# EAGLE design untitled (EAGLE 9.6.2)
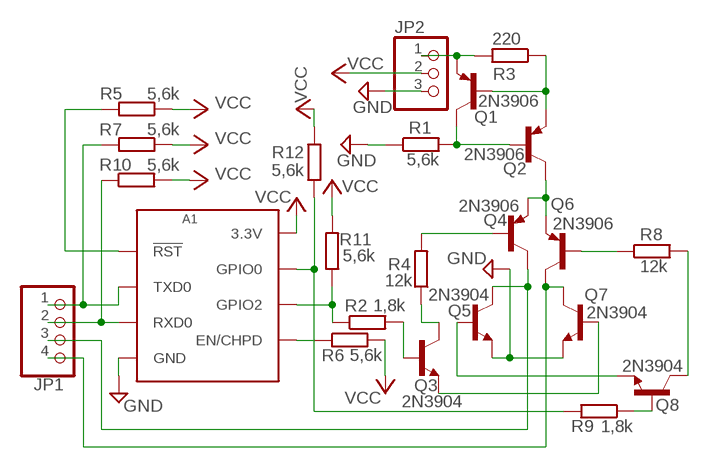
[diagram p0: schematic, sheet 1]

## Parts
A1  ESP8266_ESP-01  [ESP8266_ESP-01_NO-SILKSCREEN]
JP1  PINHD-1X4  [1X04]
JP2  PINHD-1X3  [1X03]
Q1  2N3906  2N3906-PNP-TO92-EBC  [TO92-EBC]
Q2  2N3906  2N3906-PNP-TO92-EBC  [TO92-EBC]
Q3  2N3904  2N3904-NPN-TO92-EBC  [TO92-EBC]
Q4  2N3906  2N3906-PNP-TO92-EBC  [TO92-EBC]
Q5  2N3904  2N3904-NPN-TO92-EBC  [TO92-EBC]
Q6  2N3906  2N3906-PNP-TO92-EBC  [TO92-EBC]
Q7  2N3904  2N3904-NPN-TO92-EBC  [TO92-EBC]
Q8  2N3904  2N3904-NPN-TO92-EBC  [TO92-EBC]
R1  5,6k  R-EU_0204/7  [0204/7]
R2  1,8k  R-EU_0204/7  [0204/7]
R3  220  R-EU_0204/7  [0204/7]
R4  12k  R-EU_0204/7  [0204/7]
R5  5,6k  R-EU_0204/7  [0204/7]
R6  5,6k  R-EU_0204/7  [0204/7]
R7  5,6k  R-EU_0204/7  [0204/7]
R8  12k  R-EU_0204/7  [0204/7]
R9  1,8k  R-EU_0204/7  [0204/7]
R10  5,6k  R-EU_0204/7  [0204/7]
R11  5,6k  R-EU_0204/7  [0204/7]
R12  5,6k  R-EU_0204/7  [0204/7]

## Nets
GND: A1.GND JP2.3 Q5.E Q7.E R1.1
N$1: A1.RST(!RST!) R5.2
N$2: A1.EN/CH_PD(EN/CHPD) R6.1
N$4: A1.RX(RXD0) JP1.2 R10.1
N$6: A1.GPIO0 R9.2 R12.1
N$7: Q3.B R2.2
N$8: Q3.C R4.1
N$9: Q4.B R4.2
N$10: Q2.C Q4.E Q6.E
N$11: Q1.C Q2.B R1.2
N$12: JP1.3 Q4.C Q5.C
N$13: JP2.1 Q1.E R3.2
N$14: Q1.B Q2.E R3.1
N$15: JP1.4 Q6.C Q7.C
N$16: Q6.B R8.1
N$17: Q3.E Q7.B
N$18: Q8.C R8.2
N$19: Q5.B Q8.E
N$20: Q8.B R9.1
N$21: A1.GPIO2 R2.1 R11.1
N$23: A1.TX(TXD0) JP1.1 R7.2
VCC: A1.3V3(3.3V) JP2.2 R5.1 R6.2 R7.1 R10.2 R11.2 R12.2

## Library data of the parts
A1 = LuisLab-Boards:ESP8266_ESP-?
JP1 = pinhead:PINHD-1X4: PIN HEADER
JP2 = pinhead:PINHD-1X3: PIN HEADER
Q1 Q2 Q4 Q6 = transistor-neu-to92:*-PNP-: PNP Transistror
Q3 Q5 Q7 Q8 = transistor-neu-to92:*-NPN-: NPN Transistror
R1-R12 = rcl:R-EU_: RESISTOR, European symbol; SPICEPREFIX: R

## Board
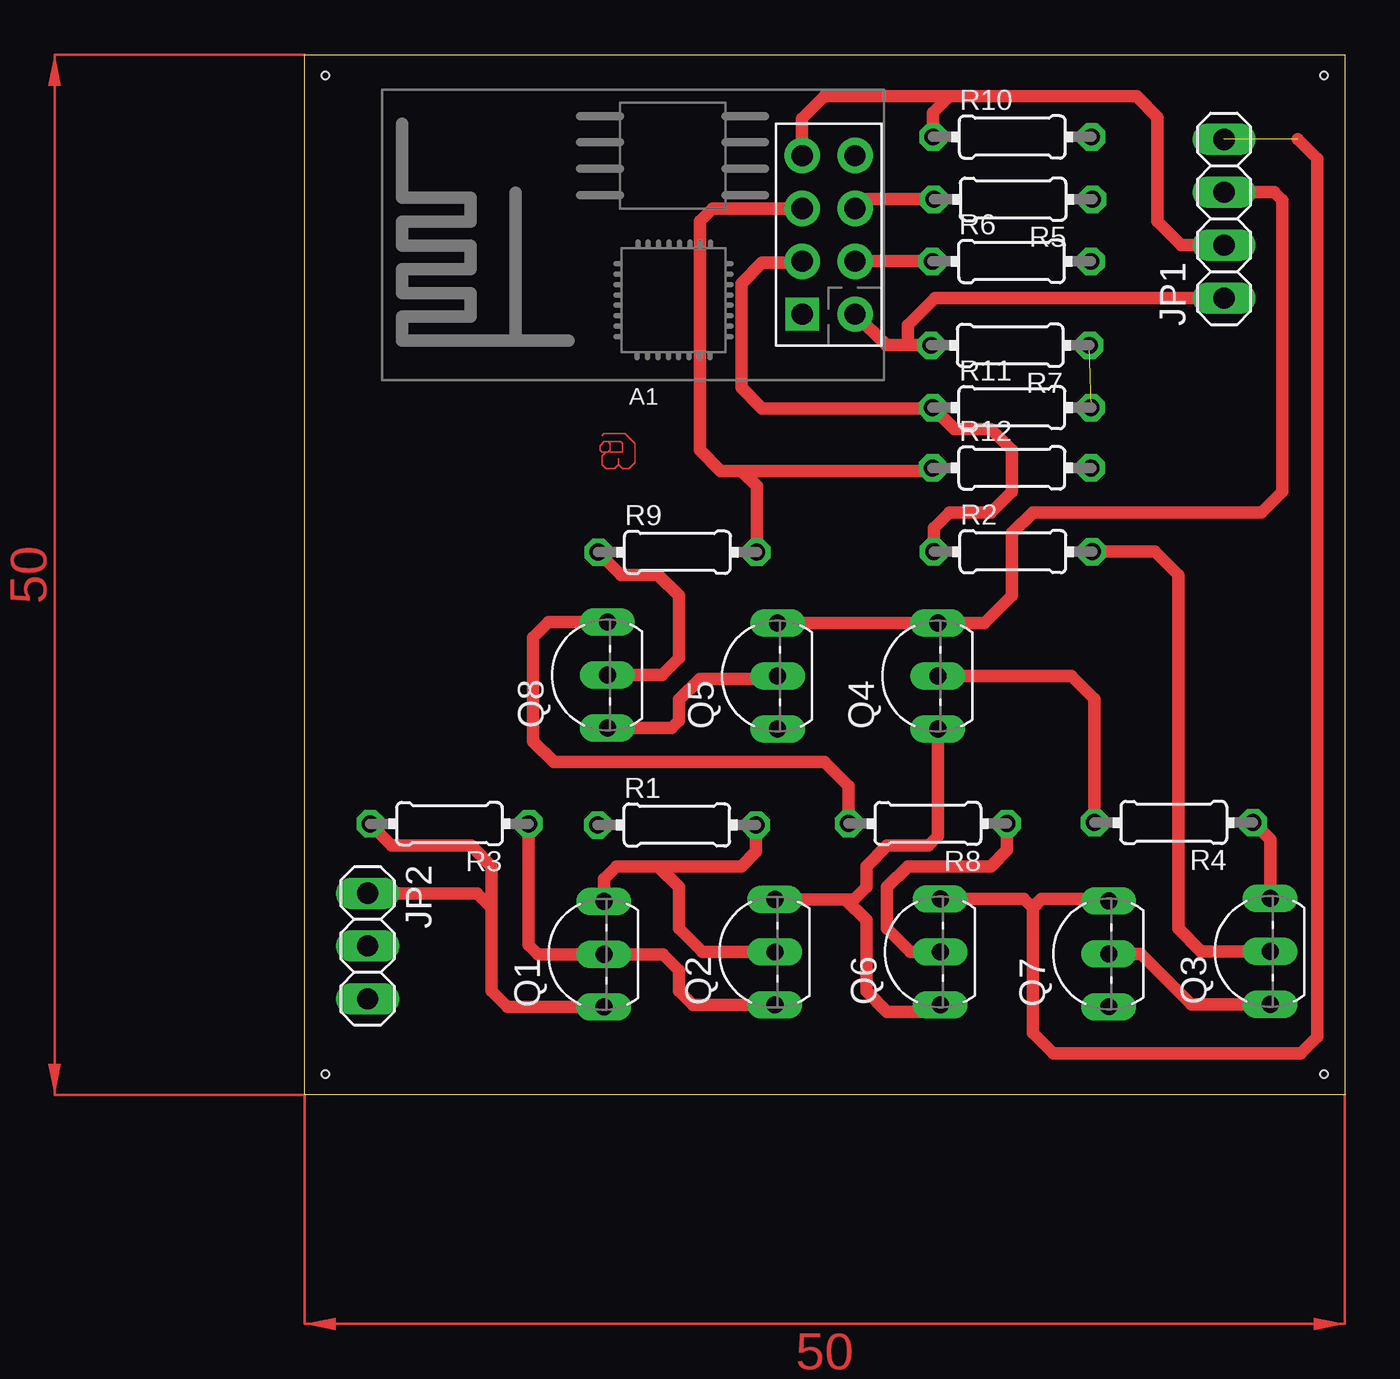
[diagram p1: board, top side]
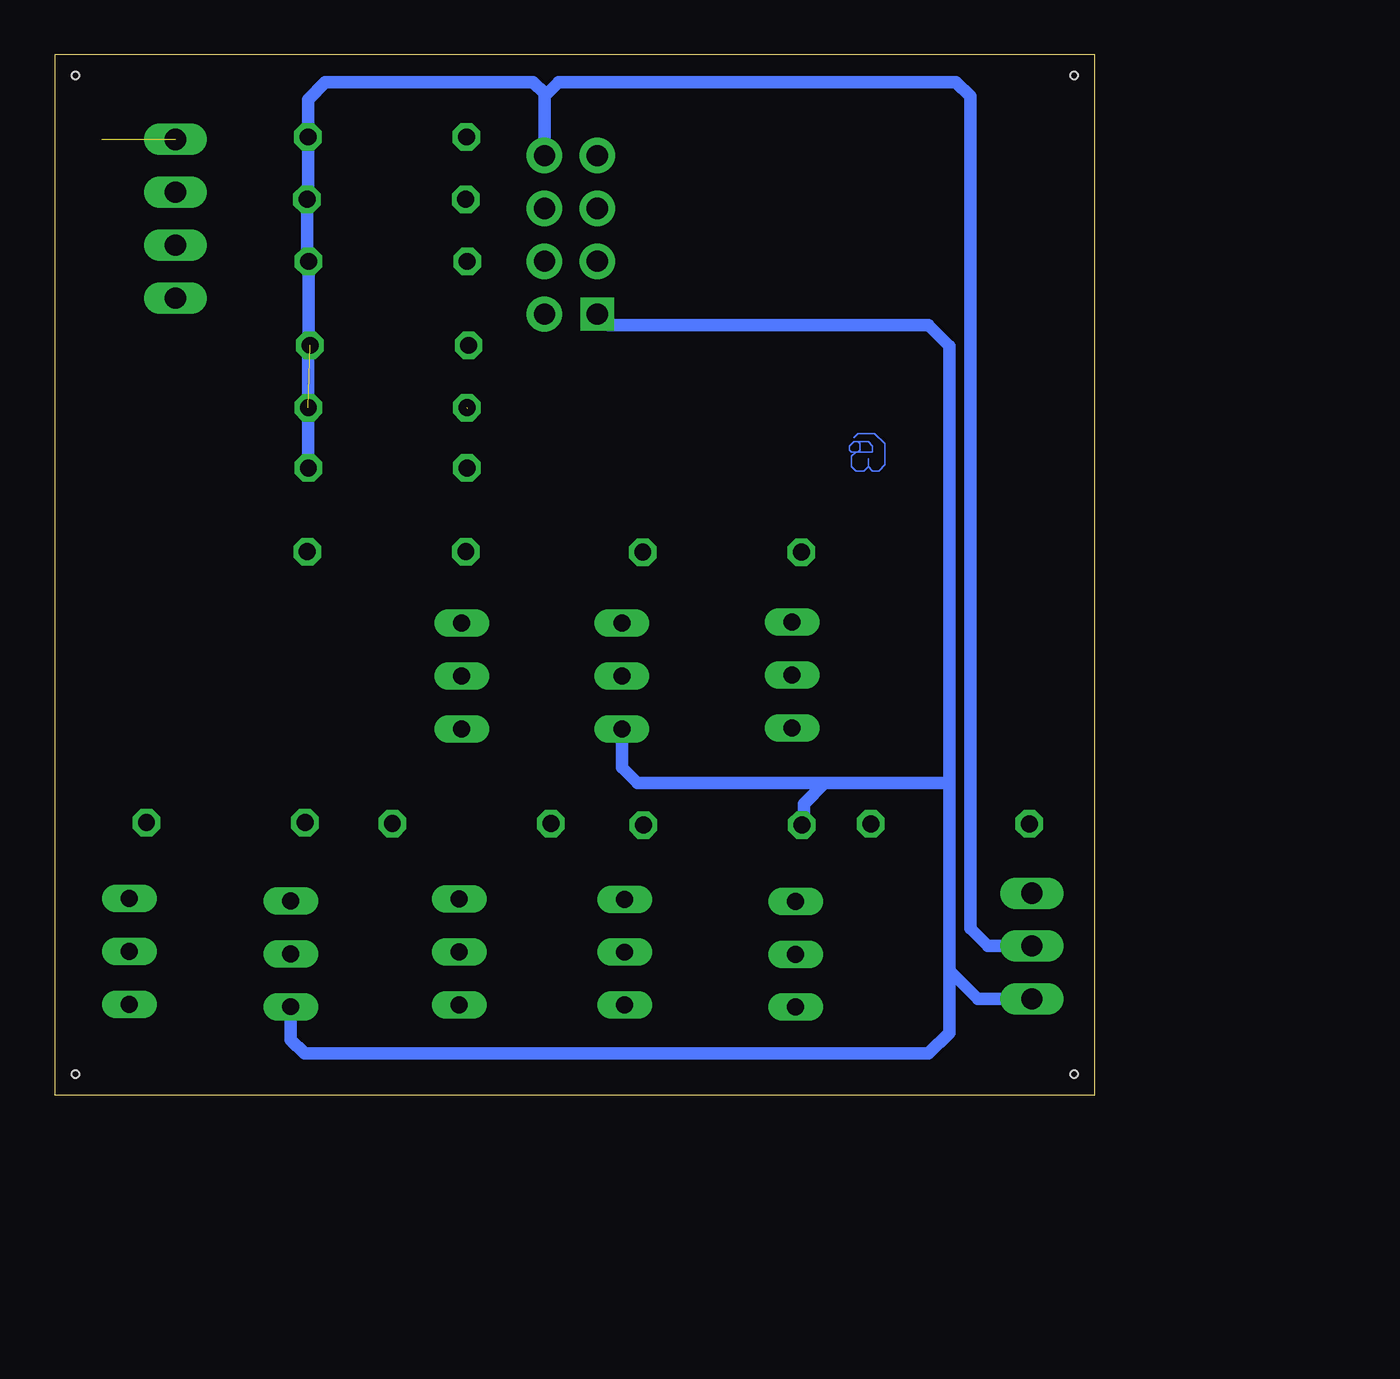
[diagram p2: board, bottom side, seen from below]

Size 50 x 50 mm. Coordinates in mm from the lower left corner, seen from the top.
Outline: 0,50 50,50 50,0 0,0 0,50
Copper layers (1*16): Top 0.035mm / dielectric 1.5mm / Bottom 0.035mm
Design rules "default": minimum track width 6mil, minimum drill 0.35mm, track to track 6mil, track to pad 6mil, pad to pad 6mil, via to via 6mil, smd to smd 6mil, copper to edge 40mil, drill to drill 6mil, minimum pad ring 10mil, minimum via ring 8mil, stop-mask expansion 4mil, vias tented up to drill 0mil, thermal gap 10mil
Holes 0.35 mm at 1,49 1,1 49,1 49,49

### Footprints (pad centres in the part's own frame; a part is rotated, then mirrored left to right if it is on the bottom)
ESP8266_ESP-01_NO-SILKSCREEN = drill 1.016 pad 1.7: 3V3 -1.27,-3.81; EN/CH_PD -1.27,1.27; GPIO0 1.27,-1.27; GPIO2 1.27,1.27; RST -1.27,-1.27; RX 1.27,-3.81; TX -1.27,3.81 | drill 1.016 pad 1.6 square: GND 1.27,3.81
1X04 = drill 1.016 long: 1 -3.81,0; 2 -1.27,0; 3 1.27,0; 4 3.81,0
1X03 = drill 1.016 long: 1 -2.54,0; 2 0,0; 3 2.54,0
TO92-EBC = drill 0.813 long: B 0,-1.27; C 2.54,-1.27; E -2.54,-1.27
0204/7 = drill 0.813 octagon: 1 -3.81,0; 2 3.81,0

### Placement (x,y rotation side)
A1  25.19,41.34 180 top
JP1  44.2,42.12 90 top
JP2  3.03,7.16 270 top
Q1  13.12,6.77 90 top
Q2  21.34,6.87 90 top
Q3  45.14,6.91 90 top
Q4  29.17,20.14 90 top
Q5  21.47,20.14 90 top
Q6  29.29,6.88 90 top
Q7  37.39,6.79 90 top
Q8  13.29,20.19 90 top
R1  17.9,12.98 0 top
R2  34.05,26.12 0 top
R3  6.97,13.04 180 top
R4  41.78,13.1 180 top
R5  34.06,43.05 180 top
R6  33.99,40.07 0 top
R7  33.92,36.03 180 top
R8  29.96,13.05 180 top
R9  17.93,26.09 0 top
R10  34.02,46.05 0 top
R11  34,33.04 0 top
R12  34,30.14 0 top

### Tracks (layer width: path | path; a pad name or v marks a point on that pad's centre or on a via)
GND
  Bottom 0.61: A1.GND 23.39,37 8,37 7,36 7,15 | 13,15 7,15 | R1.1 14,13.07 14,14 13,15 | Q5.E 22.74,15.74 22,15 13,15 | 7,6 7,15 | Q7.E 38.66,2.66 38,2 8,2 7,3 7,6 | JP2.3 5.62,4.62 7,6
N$1
  Top 0.61: A1.RST 26.9,43.05 R5.2
N$2
  Top 0.61: A1.EN/CH_PD R6.1
N$4
  Top 0.61: A1.RX 23.92,46.92 25,48 31,48 | 31,48 40,48 41,47 41,42 42.15,40.85 JP1.2 | R10.1 30.21,47.21 31,48
N$5
  Top 0.076: 14.3,31.7 14.4,31.8 15.4,31.8 15.9,31.3 15.9,30.4 15.6,30.1 15.3,30.1 15.1,30.3 | 15.1,30.3 15.1,30.6 | 15.1,30.3 14.9,30.1 14.5,30.1 14.3,30.3 14.3,30.7 14.5,30.9 | 14.6,30.9 15.3,30.9 15.3,31.3 15.2,31.4 14.6,31.4 | 14.5,30.9 14.3,30.9 14.2,31 14.2,31.2 14.4,31.4 14.6,31.4 | 14.5,30.9 14.6,30.9 | 14.6,30.9 14.7,31 14.7,31.3 14.6,31.4
N$6
  Top 0.61: A1.GPIO0 19.61,42.61 19,42 19,31 20,30 21,30 | 21,30 30.05,30 R12.1 | R9.2 21.74,29.26 21,30
N$7
  Top 0.61: Q3.B 43.09,6.91 42,8 42,25 40.88,26.12 R2.2
N$8
  Top 0.61: Q3.C 46.41,12.28 R4.1
N$9
  Top 0.61: R4.2 37.97,19.03 36.86,20.14 Q4.B
N$10
  Top 0.61: Q2.C 26,9.41 | 26,9.41 26.41,9.41 27,10 27,11 28,12 30,12 30.44,12.44 Q4.E | 26,9.41 27,8.41 27,5 28,4 30.22,4 Q6.E
N$11
  Top 0.61: R1.2 21.71,11.71 21,11 17,11 | Q1.C 14.39,10.39 15,11 17,11 | Q2.B 19.13,6.87 18,8 18,10 17,11
N$12
  Top 0.61: Q5.C Q4.C 32.68,22.68 34,24 34,27 35,28 46,28 47,29 47,43 46.61,43.39 JP1.3
N$13
  Top 0.61: Q1.E 9.77,4.23 9,5 9,9 | 9,9 8.3,9.7 JP2.1 | R3.2 4.2,12 8,12 9,11 9,9
N$14
  Top 0.61: R3.1 10.78,7.22 11.23,6.77 Q1.B 17.23,6.77 18,6 18,5 18.67,4.33 Q2.E
N$15  (1 unrouted)
  Top 0.61: Q7.C 38.57,9.42 35.42,9.42 35,9 | 47.75,45.93 48.68,45 48.68,2.8 47.88,2 36,2 35,3 35,9 | Q6.C 34.58,9.42 35,9
N$16
  Top 0.61: R8.1 33.77,11.77 33,11 29,11 28,10 28,8 29.12,6.88 Q6.B
N$17
  Top 0.61: Q7.B 40.21,6.79 42.63,4.37 Q3.E
N$18
  Top 0.61: Q8.C 11.73,22.73 11,22 11,17 12,16 25,16 26.15,14.85 R8.2
N$19
  Top 0.61: Q8.E 17.65,17.65 18,18 18,19 19,20 22.6,20 Q5.B
N$20
  Top 0.61: R9.1 15.21,25 17,25 18,24 18,21 17.19,20.19 Q8.B
N$21  (1 unrouted)
  Top 0.61: A1.GPIO2 23.85,40 22,40 21,39 21,34 22,33 30.15,33 | R11.1 31.23,32 33,32 34,31 34,29 33,28 31,28 30.24,27.24 R2.1
N$22
  Bottom 0.076: 11.6,31.6 11.4,31.8 10.6,31.8 10.1,31.3 10.1,30.3 10.4,30 10.7,30 10.9,30.2 | 10.9,30.6 10.9,30.2 | 10.9,30.2 11.1,30 11.5,30 11.7,30.2 11.7,30.7 11.5,30.9 | 11.5,30.9 11.4,30.9 | 11.4,30.9 10.7,30.9 10.7,31.2 10.9,31.4 11.4,31.4 | 11.5,30.9 11.7,30.9 11.8,31 11.8,31.2 11.6,31.4 11.4,31.4 | 11.4,30.9 11.3,31 11.3,31.3 11.4,31.4
N$23
  Top 0.61: A1.TX 27.96,36.03 29,36.03 | 29,36.03 R7.2 | JP1.1 30.31,38.31 29,37 29,36.03
VCC  (1 unrouted)
  Bottom 0.61: A1.3V3 26.46,48 | 26.46,48 26.46,48.14 27,48.68 37,48.68 37.83,47.85 R10.2 | 26.46,48 25.79,48.68 6.68,48.68 6,48 6,8 5.16,7.16 JP2.2 | R12.2 R11.2 37.81,35.95 37.8,35.97 R6.2 | 37.73,40 R6.2 | 37.87,46.01 R10.2 | R10.2 37.83,43.09 R5.1 37.87,40.14 R6.2
(copper drawn outside any net)
  shapes: Top area x2